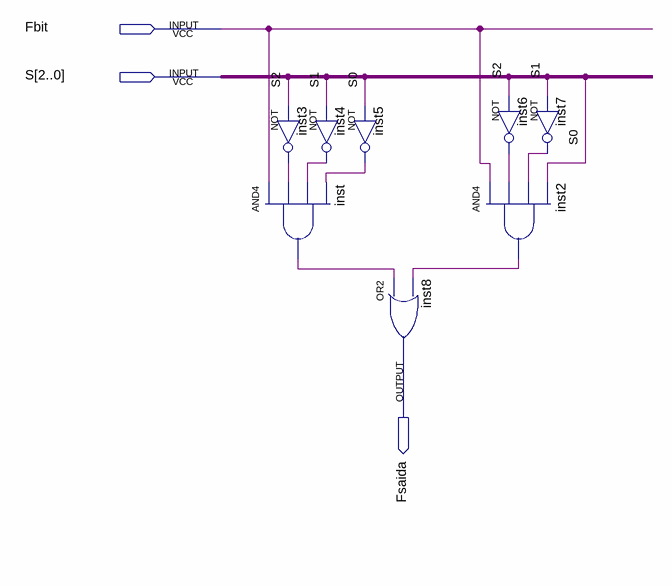
[diagram p0: schematic sheet]
// Quartus schematic MiniMux7Seg.bdf as structural Verilog: 8 symbols, 3 pins
module MiniMux7Seg (
  input  Fbit,
  input  [2:0] S,
  output Fsaida
);

  wire inst2_out, inst3_out, inst4_out, inst5_out, inst6_out, inst7_out, inst_out;

  and inst (inst_out, Fbit, inst3_out, inst4_out, inst5_out);
  not inst3 (inst3_out, S[2]);
  not inst4 (inst4_out, S[1]);
  not inst5 (inst5_out, S[0]);
  or inst8 (Fsaida, inst_out, inst2_out);
  not inst6 (inst6_out, S[2]);
  and inst2 (inst2_out, Fbit, inst6_out, inst7_out, S[0]);
  not inst7 (inst7_out, S[1]);
endmodule
